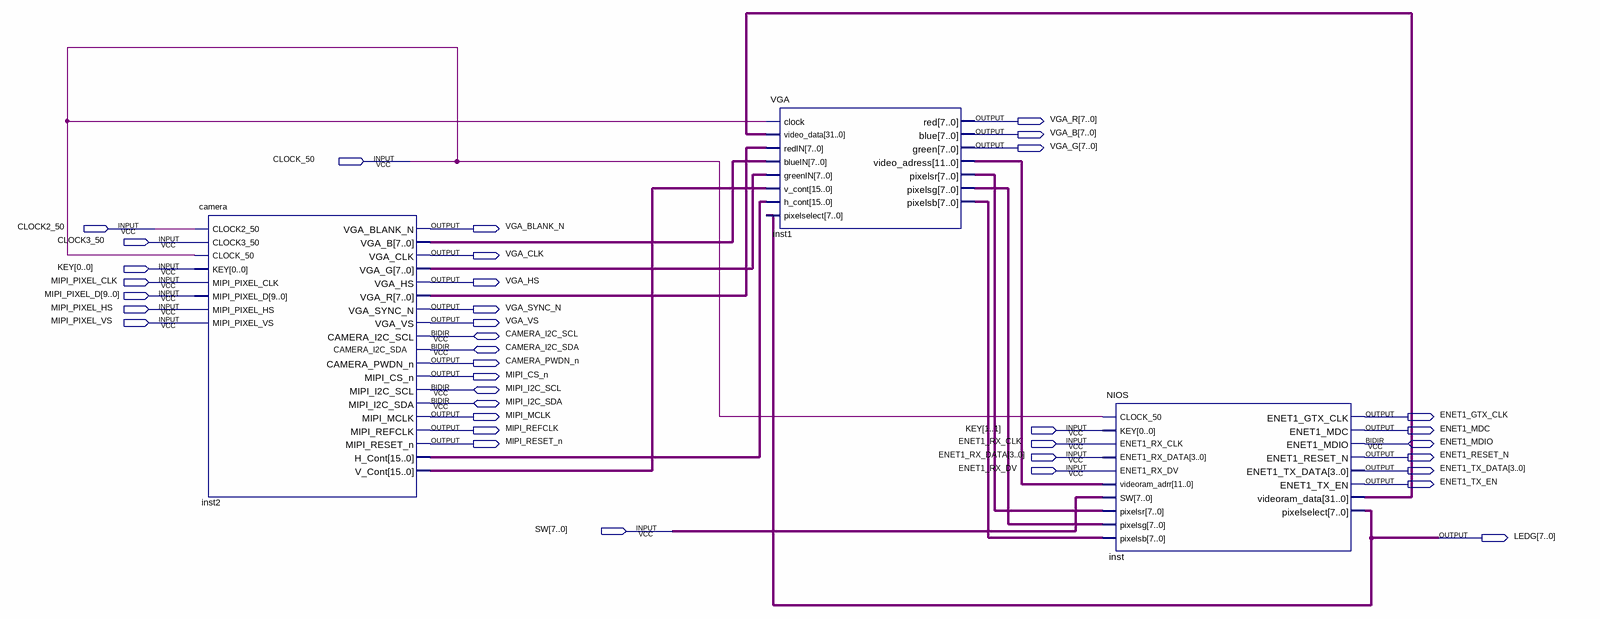
[diagram p0: schematic sheet]
// Quartus schematic barcodescanner.bdf as structural Verilog: 3 symbols, 37 pins
module barcodescanner (
  input  CLOCK_50,
  input  CLOCK2_50,
  input  CLOCK3_50,
  input  [1:0] KEY,
  input  MIPI_PIXEL_CLK,
  input  [9:0] MIPI_PIXEL_D,
  input  MIPI_PIXEL_HS,
  input  MIPI_PIXEL_VS,
  input  ENET1_RX_CLK,
  input  [3:0] ENET1_RX_DATA,
  input  ENET1_RX_DV,
  input  [7:0] SW,
  inout  CAMERA_I2C_SCL,
  inout  CAMERA_I2C_SDA,
  inout  MIPI_I2C_SCL,
  inout  MIPI_I2C_SDA,
  inout  ENET1_MDIO,
  output [7:0] VGA_R,
  output [7:0] VGA_B,
  output [7:0] VGA_G,
  output VGA_BLANK_N,
  output VGA_CLK,
  output VGA_HS,
  output VGA_SYNC_N,
  output VGA_VS,
  output CAMERA_PWDN_n,
  output MIPI_CS_n,
  output MIPI_MCLK,
  output ENET1_GTX_CLK,
  output MIPI_REFCLK,
  output ENET1_MDC,
  output MIPI_RESET_n,
  output ENET1_RESET_N,
  output [3:0] ENET1_TX_DATA,
  output ENET1_TX_EN,
  output [7:0] LEDG
);

  wire [7:0] inst1_pixelsb, inst1_pixelsg, inst1_pixelsr, inst2_vga_b, inst2_vga_g, inst2_vga_r;
  wire [11:0] inst1_video_adress;
  wire [15:0] inst2_h_cont, inst2_v_cont;
  wire [31:0] inst_videoram_data;

  camera inst2 (
    .CLOCK2_50(CLOCK2_50), .CLOCK3_50(CLOCK3_50), .CLOCK_50(CLOCK_50), .KEY(KEY[0]),
    .MIPI_PIXEL_CLK(MIPI_PIXEL_CLK), .MIPI_PIXEL_D(MIPI_PIXEL_D), .MIPI_PIXEL_HS(MIPI_PIXEL_HS),
    .MIPI_PIXEL_VS(MIPI_PIXEL_VS), .VGA_BLANK_N(VGA_BLANK_N), .VGA_B(inst2_vga_b), .VGA_CLK(VGA_CLK),
    .VGA_G(inst2_vga_g), .VGA_HS(VGA_HS), .VGA_R(inst2_vga_r), .VGA_SYNC_N(VGA_SYNC_N), .VGA_VS(VGA_VS),
    .CAMERA_PWDN_n(CAMERA_PWDN_n), .MIPI_CS_n(MIPI_CS_n), .MIPI_MCLK(MIPI_MCLK), .MIPI_REFCLK(MIPI_REFCLK),
    .MIPI_RESET_n(MIPI_RESET_n), .H_Cont(inst2_h_cont), .V_Cont(inst2_v_cont),
    .CAMERA_I2C_SCL(CAMERA_I2C_SCL), .CAMERA_I2C_SDA(CAMERA_I2C_SDA), .MIPI_I2C_SCL(MIPI_I2C_SCL),
    .MIPI_I2C_SDA(MIPI_I2C_SDA));
  VGA inst1 (
    .clock(CLOCK_50), .video_data(inst_videoram_data), .redIN(inst2_vga_r), .blueIN(inst2_vga_b),
    .greenIN(inst2_vga_g), .v_cont(inst2_v_cont), .h_cont(inst2_h_cont), .pixelselect(LEDG), .red(VGA_R),
    .blue(VGA_B), .green(VGA_G), .video_adress(inst1_video_adress), .pixelsr(inst1_pixelsr),
    .pixelsg(inst1_pixelsg), .pixelsb(inst1_pixelsb));
  NIOS inst (
    .CLOCK_50(CLOCK_50), .KEY(KEY[1]), .ENET1_RX_CLK(ENET1_RX_CLK), .ENET1_RX_DATA(ENET1_RX_DATA),
    .ENET1_RX_DV(ENET1_RX_DV), .videoram_adrr(inst1_video_adress), .SW(SW), .pixelsr(inst1_pixelsr),
    .pixelsg(inst1_pixelsg), .pixelsb(inst1_pixelsb), .ENET1_GTX_CLK(ENET1_GTX_CLK), .ENET1_MDC(ENET1_MDC),
    .ENET1_RESET_N(ENET1_RESET_N), .ENET1_TX_DATA(ENET1_TX_DATA), .ENET1_TX_EN(ENET1_TX_EN),
    .videoram_data(inst_videoram_data), .pixelselect(LEDG), .ENET1_MDIO(ENET1_MDIO));
endmodule
